# EAGLE design pushbutton (EAGLE 7.3.0)
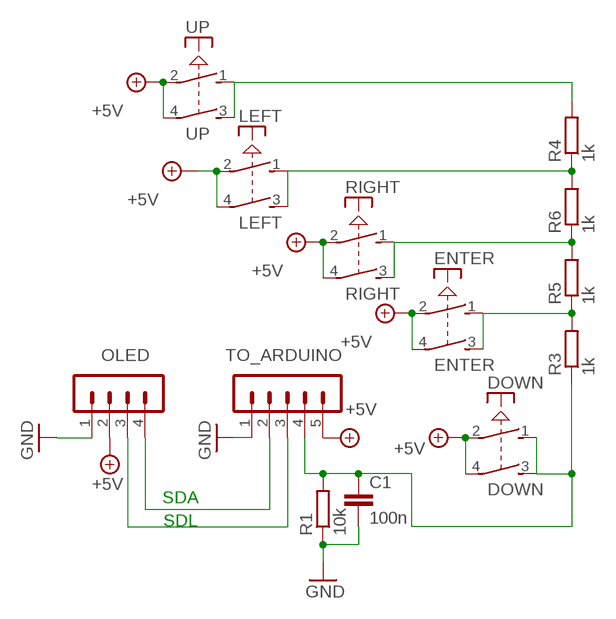
[diagram p0: schematic, sheet 1]

## Parts
C1  100n  C-EU025-030X050  [C025-030X050]
DOWN  PVA1R  [PVA1R]
ENTER  PVA1R  [PVA1R]
LEFT  PVA1R  [PVA1R]
OLED  MA04-1  [MA04-1]
R1  10k  R-EU_0207/10  [0207/10]
R3  1k  R-EU_0207/10  [0207/10]
R4  1k  R-EU_0207/10  [0207/10]
R5  1k  R-EU_0207/10  [0207/10]
R6  1k  R-EU_0207/10  [0207/10]
RIGHT  PVA1R  [PVA1R]
TO_ARDUINO  MA05-1  [MA05-1]
UP  PVA1R  [PVA1R]

## Nets
+5V: DOWN.2(1:P) DOWN.4(2:P) ENTER.2(1:P) ENTER.4(2:P) LEFT.2(1:P) LEFT.4(2:P) OLED.2 RIGHT.2(1:P) RIGHT.4(2:P) TO_ARDUINO.5 UP.2(1:P) UP.4(2:P)
GND: C1.2 OLED.1 R1.1 TO_ARDUINO.1
N$1: ENTER.1(1:S) ENTER.3(2:S) R3.2 R5.1
N$3: R4.2 UP.1(1:S) UP.3(2:S)
N$7: C1.1 DOWN.1(1:S) DOWN.3(2:S) R1.2 R3.1 TO_ARDUINO.4
N$12: R5.2 R6.1 RIGHT.1(1:S) RIGHT.3(2:S)
N$15: LEFT.1(1:S) LEFT.3(2:S) R4.1 R6.2
SCL: OLED.3 TO_ARDUINO.3
SDA: OLED.4 TO_ARDUINO.2

## Notes on the sheet
- SDA
- SDL

## Library data of the parts
C1 = rcl:C-EU: CAPACITOR, European symbol
DOWN ENTER LEFT RIGHT UP = switch-misc:PVA1R: ITT SWITCH
OLED = con-lstb:MA04-1: PIN HEADER; OC_FARNELL: unknown; OC_NEWARK: unknown
R1 R3-R6 = rcl:R-EU_: RESISTOR, European symbol
TO_ARDUINO = con-lstb:MA05-1: PIN HEADER; OC_FARNELL: unknown; OC_NEWARK: unknown

## Net classes
0 default: width 0.076 mm, drill 0.025 mm, clearance 0.013 mm

## Board
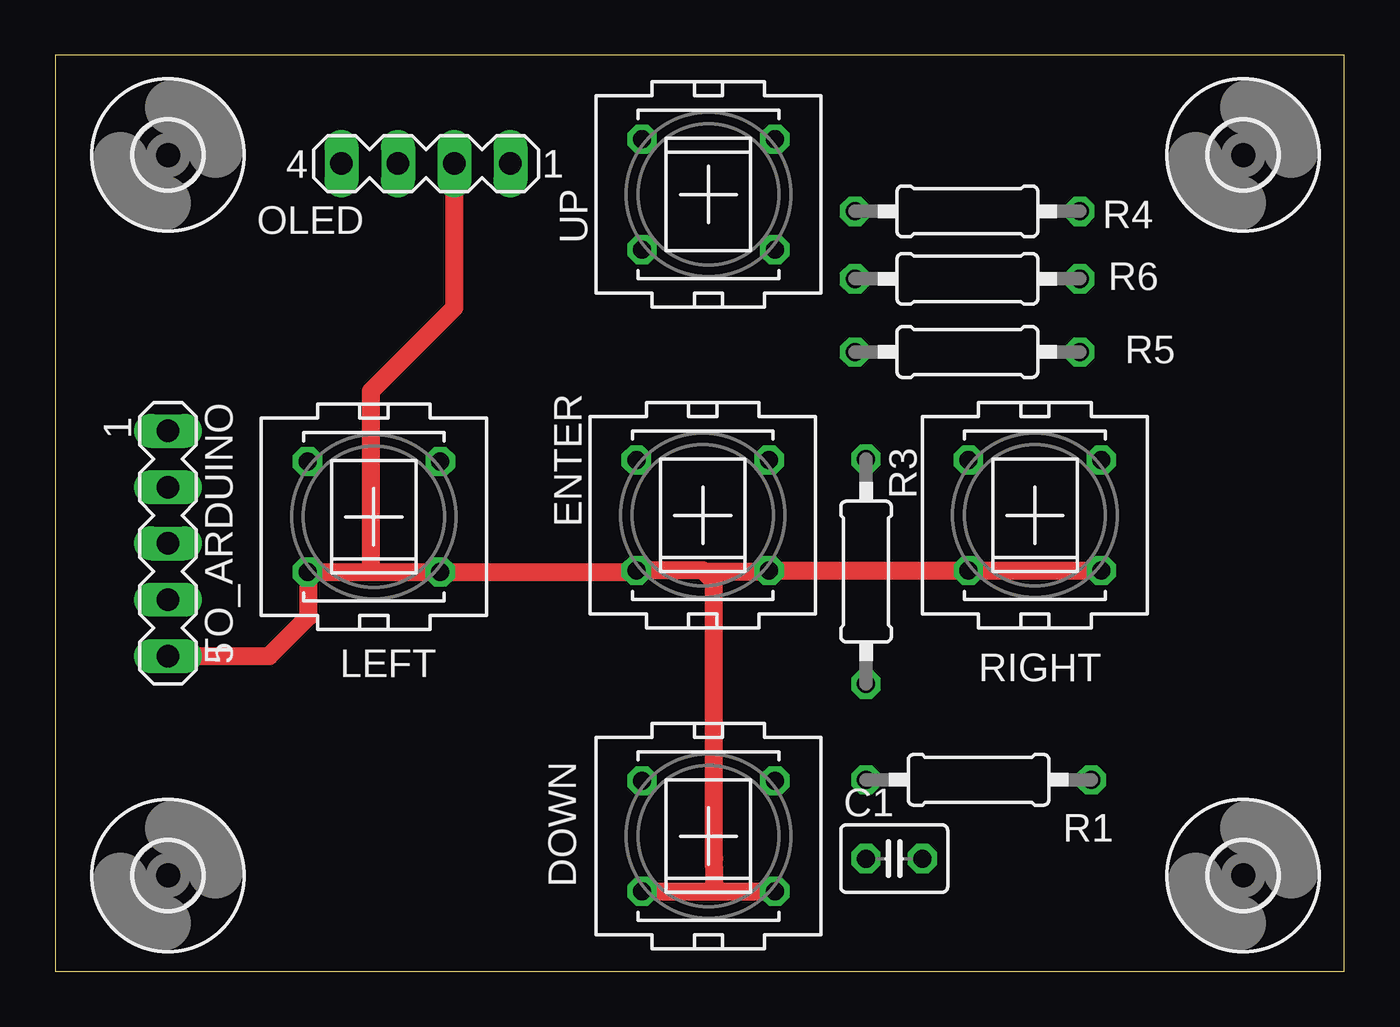
[diagram p1: board, top side]
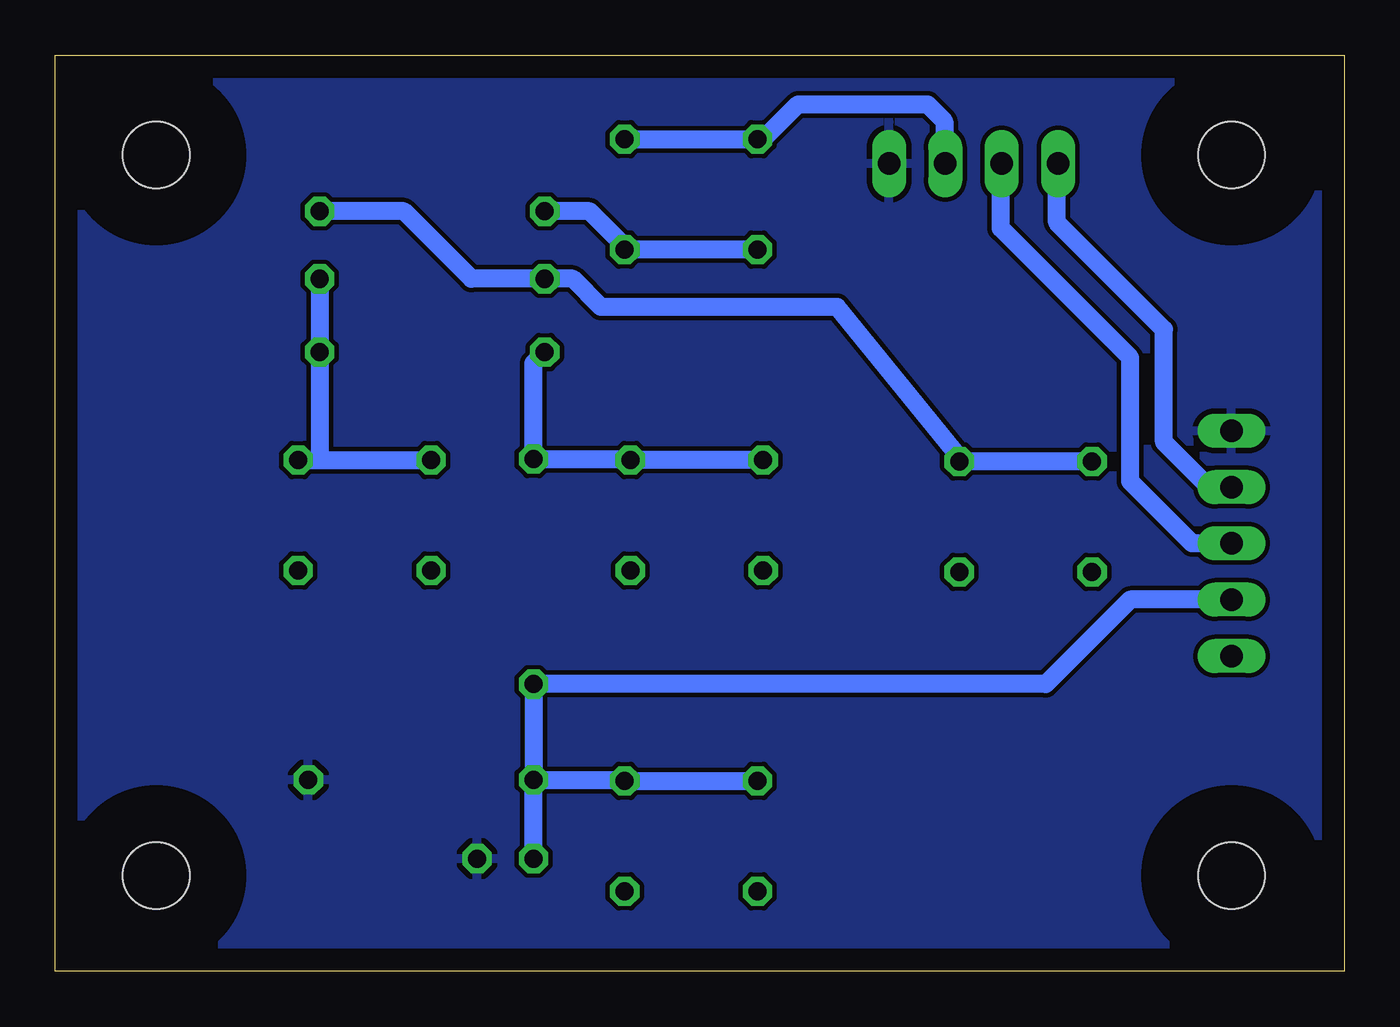
[diagram p2: board, bottom side, seen from below]

Size 58.15 x 41.33 mm. Coordinates in mm from the lower left corner, seen from the top.
Outline: 0,0 58.15,0 58.15,41.33 0,41.33 0,0
Copper layers (1*16): Top 0.035mm / dielectric 1.5mm / Bottom 0.035mm
Design rules "default": minimum track width 10mil, minimum drill 24mil, track to track 8mil, track to pad 8mil, pad to pad 8mil, via to via 8mil, smd to smd 8mil, copper to edge 40mil, drill to drill 8mil, minimum pad ring 10mil, minimum via ring 8mil, stop-mask expansion 4mil, vias tented up to drill 0mil, thermal gap 10mil

### Footprints (pad centres in the part's own frame; a part is rotated, then mirrored left to right if it is on the bottom)
C025-030X050 = drill 0.813 octagon: 1 -1.27,0; 2 1.27,0
PVA1R = drill 0.813 octagon: 1 -2.997,2.489; 2 -2.997,-2.489; 3 2.997,2.489; 4 2.997,-2.489
MA04-1 = drill 1.016 long: 1 -3.81,0; 2 -1.27,0; 3 1.27,0; 4 3.81,0
0207/10 = drill 0.813 octagon: 1 -5.08,0; 2 5.08,0
MA05-1 = drill 1.016 long: 1 -5.08,0; 2 -2.54,0; 3 0,0; 4 2.54,0; 5 5.08,0
3,0 = hole 3: 0,0

### Placement (x,y rotation side)
C1  37.85,5.08 0 top
DOWN  29.46,6.1 0 top
ENTER  29.21,20.57 0 top
LEFT  14.37,20.51 0 top
OLED  16.72,36.44 180 top
R1  41.66,8.64 180 top
R3  36.58,18.03 90 top
R4  41.15,34.29 180 top
R5  41.15,27.94 0 top
R6  41.15,31.24 180 top
RIGHT  44.2,20.57 0 top
TO_ARDUINO  5.08,19.3 270 top
U$1  [3,0]  5.08,36.83 0 top
U$2  [3,0]  5.08,4.32 0 top
U$3  [3,0]  53.59,4.32 0 top
U$4  [3,0]  53.59,36.83 0 top
UP  29.46,35.05 180 top

### Tracks (layer width: path | path; a pad name or v marks a point on that pad's centre or on a via)
+5V
  Top 0.813: OLED.2 17.99,29.93 14.22,26.16 14.22,18.02 LEFT.4 | 29.77,3.61 29.72,5.08 29.72,17.58 | 29.72,17.58 29.21,18.09 ENTER.2 26.14,18.02 LEFT.4 | DOWN.2 29.77,3.61 | 29.77,3.61 DOWN.4 | TO_ARDUINO.5 9.65,14.22 11.43,16 11.43,17.96 LEFT.2 LEFT.4 | 29.72,17.58 29.72,17.78 29.46,18.03 32.16,18.03 ENTER.4 RIGHT.2 RIGHT.4
  Bottom 0.813: 26.14,18.02 ENTER.2 | UP.2 UP.4 26.21,37.54 24.64,39.12 18.8,39.12 18.03,38.35 18.03,36.48 OLED.2
GND
  pour Bottom: 0,43.18 65.02,42.93 68.58,-3.3 -0.51,0.25 -3.05,7.37
N$1
  Bottom 0.813: 26.16,23.11 ENTER.1 ENTER.3 32.26,23.11 R3.2 36.58,27.43 R5.1
N$3
  Bottom 0.813: UP.3 UP.1 32.46,32.72 34.04,34.29 R4.2
N$7
  Bottom 0.813: 26.42,8.64 DOWN.1 DOWN.3 32.51,8.64 R1.2 | C1.1 R1.2 | TO_ARDUINO.4 9.65,16.76 13.46,12.95 R3.1 R1.2
N$12
  Bottom 0.813: R6.1 R5.2 46.23,23.06 | RIGHT.3 46.23,23.06 | 46.23,23.06 RIGHT.1
N$15
  Bottom 0.813: LEFT.1 LEFT.3 17.36,23.21 22.86,29.97 33.53,29.97 34.8,31.24 R6.2 39.37,31.24 42.42,34.29 R4.1
SCL
  Bottom 0.813: TO_ARDUINO.3 6.86,19.3 9.65,22.1 9.65,27.69 15.49,33.53 15.49,36.4 OLED.3
SDA
  Bottom 0.813: TO_ARDUINO.2 6.1,21.84 8.13,23.88 8.13,28.96 12.95,33.78 12.95,36.4 OLED.4